# Altium schematic sheet STM32.SchDoc
size A4; SheetNumber: 2; SheetTotal: 6
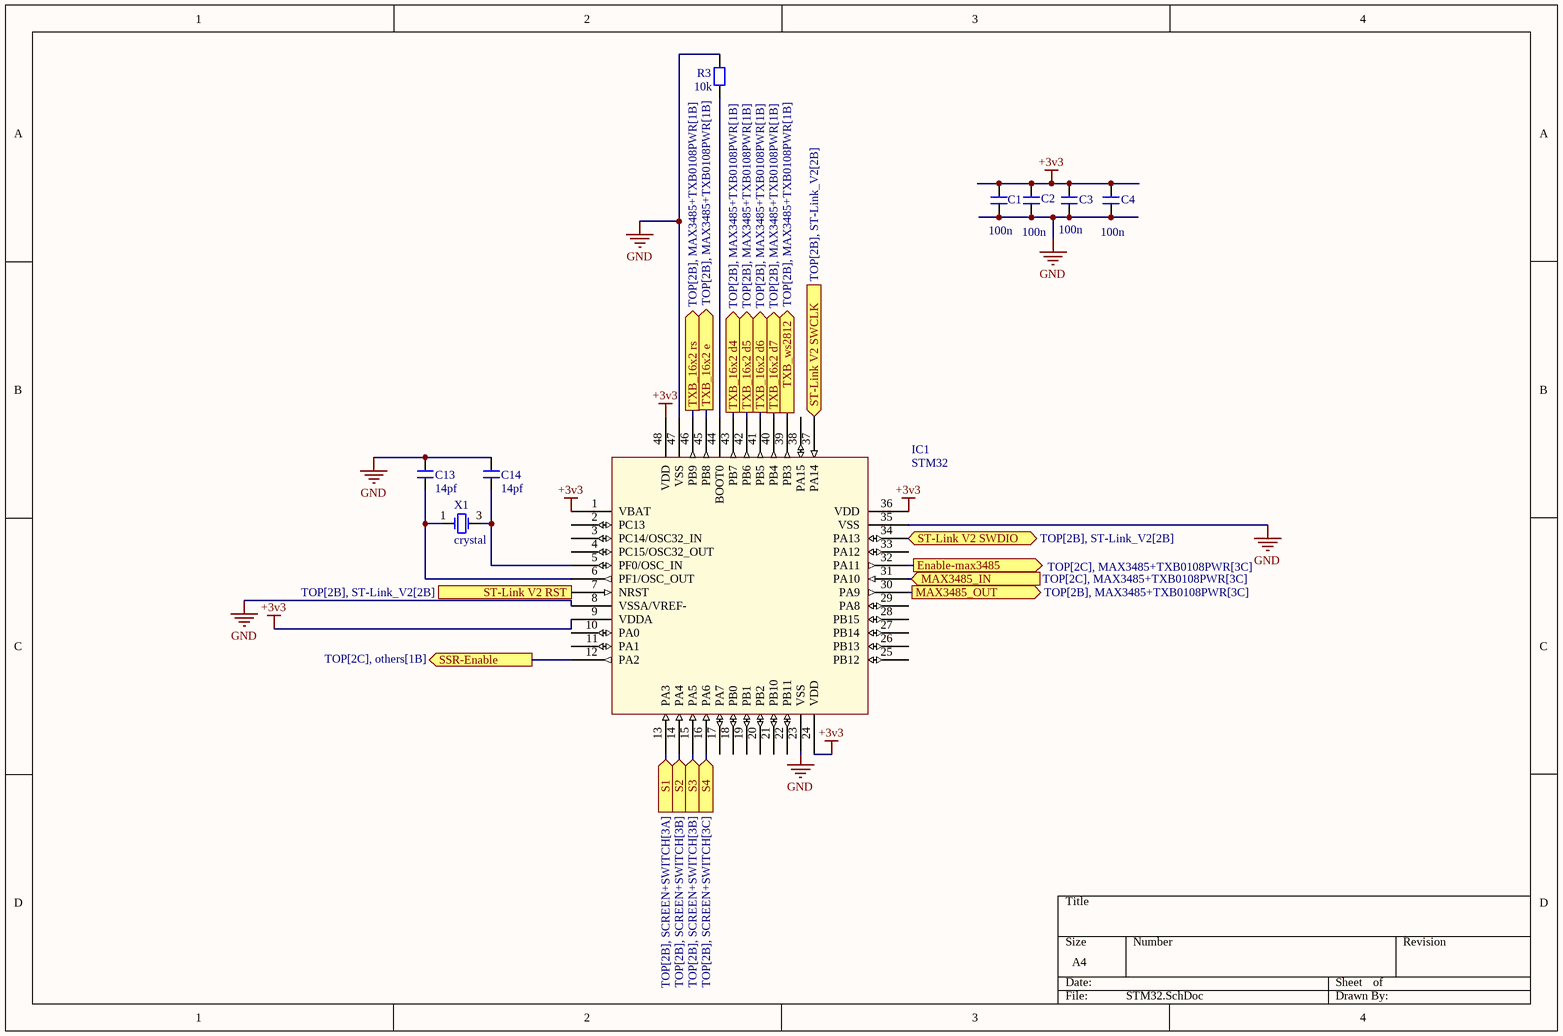
[diagram p0: STM32.SchDoc]

## Parts
C1  100n  [0805]
C2  100n  [0805]
C3  100n  [0805]
C4  100n  [0805]
C13  14pf  [0805]
C14  14pf  [0805]
IC1  STM32  [STM32]
R3  10k  [0805]
X1  crystal  [crystal]

## Ports
Enable-max3485 (out, see TOP[2C], MAX3485+TXB0108PWR[3C]), MAX3485_IN (in, see TOP[2C], MAX3485+TXB0108PWR[3C]), MAX3485_OUT (out, see TOP[2B], MAX3485+TXB0108PWR[3C]), S1 (in, see TOP[2B], SCREEN+SWITCH[3A]), S2 (in, see TOP[2B], SCREEN+SWITCH[3B]), S3 (in, see TOP[2B], SCREEN+SWITCH[3B]), S4 (in, see TOP[2B], SCREEN+SWITCH[3C]), SSR-Enable (out, see TOP[2C], others[1B]), ST-Link V2 RST (in, see TOP[2B], ST-Link_V2[2B]), ST-Link V2 SWCLK (in, see TOP[2B], ST-Link_V2[2B]), ST-Link V2 SWDIO (bidir, see TOP[2B], ST-Link_V2[2B]), TXB_16x2 d4 (out, see TOP[2B], MAX3485+TXB0108PWR[1B]), TXB_16x2 d5 (out, see TOP[2B], MAX3485+TXB0108PWR[1B]), TXB_16x2 d6 (out, see TOP[2B], MAX3485+TXB0108PWR[1B]), TXB_16x2 d7 (out, see TOP[2B], MAX3485+TXB0108PWR[1B]), TXB_16x2 e (out, see TOP[2B], MAX3485+TXB0108PWR[1B]), TXB_16x2 rs (out, see TOP[2B], MAX3485+TXB0108PWR[1B]), TXB_ws2812 (out, see TOP[2B], MAX3485+TXB0108PWR[1B])

## Nets
+3v3: C1.1 C2.1 C3.1 C4.1 IC1.1(VBAT) IC1.9(VDDA) IC1.24(VDD) IC1.36(VDD) IC1.48(VDD)
GND: C1.2 C2.2 C3.2 C4.2 C13.1 C14.1 IC1.8(VSSA/VREF-) IC1.23(VSS) IC1.35(VSS) IC1.47(VSS) R3.1
Enable-max3485: IC1.32(PA11) ; port Enable-max3485
MAX3485_IN: IC1.31(PA10) ; port MAX3485_IN
MAX3485_OUT: IC1.30(PA9) ; port MAX3485_OUT
S1: IC1.13(PA3) ; port S1
S2: IC1.14(PA4) ; port S2
S3: IC1.15(PA5) ; port S3
S4: IC1.16(PA6) ; port S4
SSR-Enable: IC1.12(PA2) ; port SSR-Enable
ST-Link V2 RST: IC1.7(NRST) ; port ST-Link V2 RST
ST-Link V2 SWCLK: IC1.37(PA14) ; port ST-Link V2 SWCLK
ST-Link V2 SWDIO: IC1.34(PA13) ; port ST-Link V2 SWDIO
TXB_16x2 d4: IC1.43(PB7) ; port TXB_16x2 d4
TXB_16x2 d5: IC1.42(PB6) ; port TXB_16x2 d5
TXB_16x2 d6: IC1.41(PB5) ; port TXB_16x2 d6
TXB_16x2 d7: IC1.40(PB4) ; port TXB_16x2 d7
TXB_16x2 e: IC1.45(PB8) ; port TXB_16x2 e
TXB_16x2 rs: IC1.46(PB9) ; port TXB_16x2 rs
TXB_ws2812: IC1.39(PB3) ; port TXB_ws2812
NetC13_2: C13.2 IC1.6(PF1/OSC_OUT) X1.1(OSC1)
NetC14_2: C14.2 IC1.5(PF0/OSC_IN) X1.3(OSC2)
NetIC1_44: IC1.44(BOOT0) R3.2

Not connected (* = marked no-connect by the designer): IC1 2(PC13) 3(PC14/OSC32_IN) 4(PC15/OSC32_OUT) 10(PA0) 11(PA1) 17(PA7) 18(PB0) 19(PB1) 20(PB2) 21(PB10) 22(PB11) 25(PB12) 26(PB13) 27(PB14) 28(PB15) 29(PA8) 33(PA12) 38(PA15)

## Library data of the parts
C1-C4 C13 C14 = capacitor
R3 = resistor